# EAGLE design RPi-XBee-SMT (EAGLE 6.2)
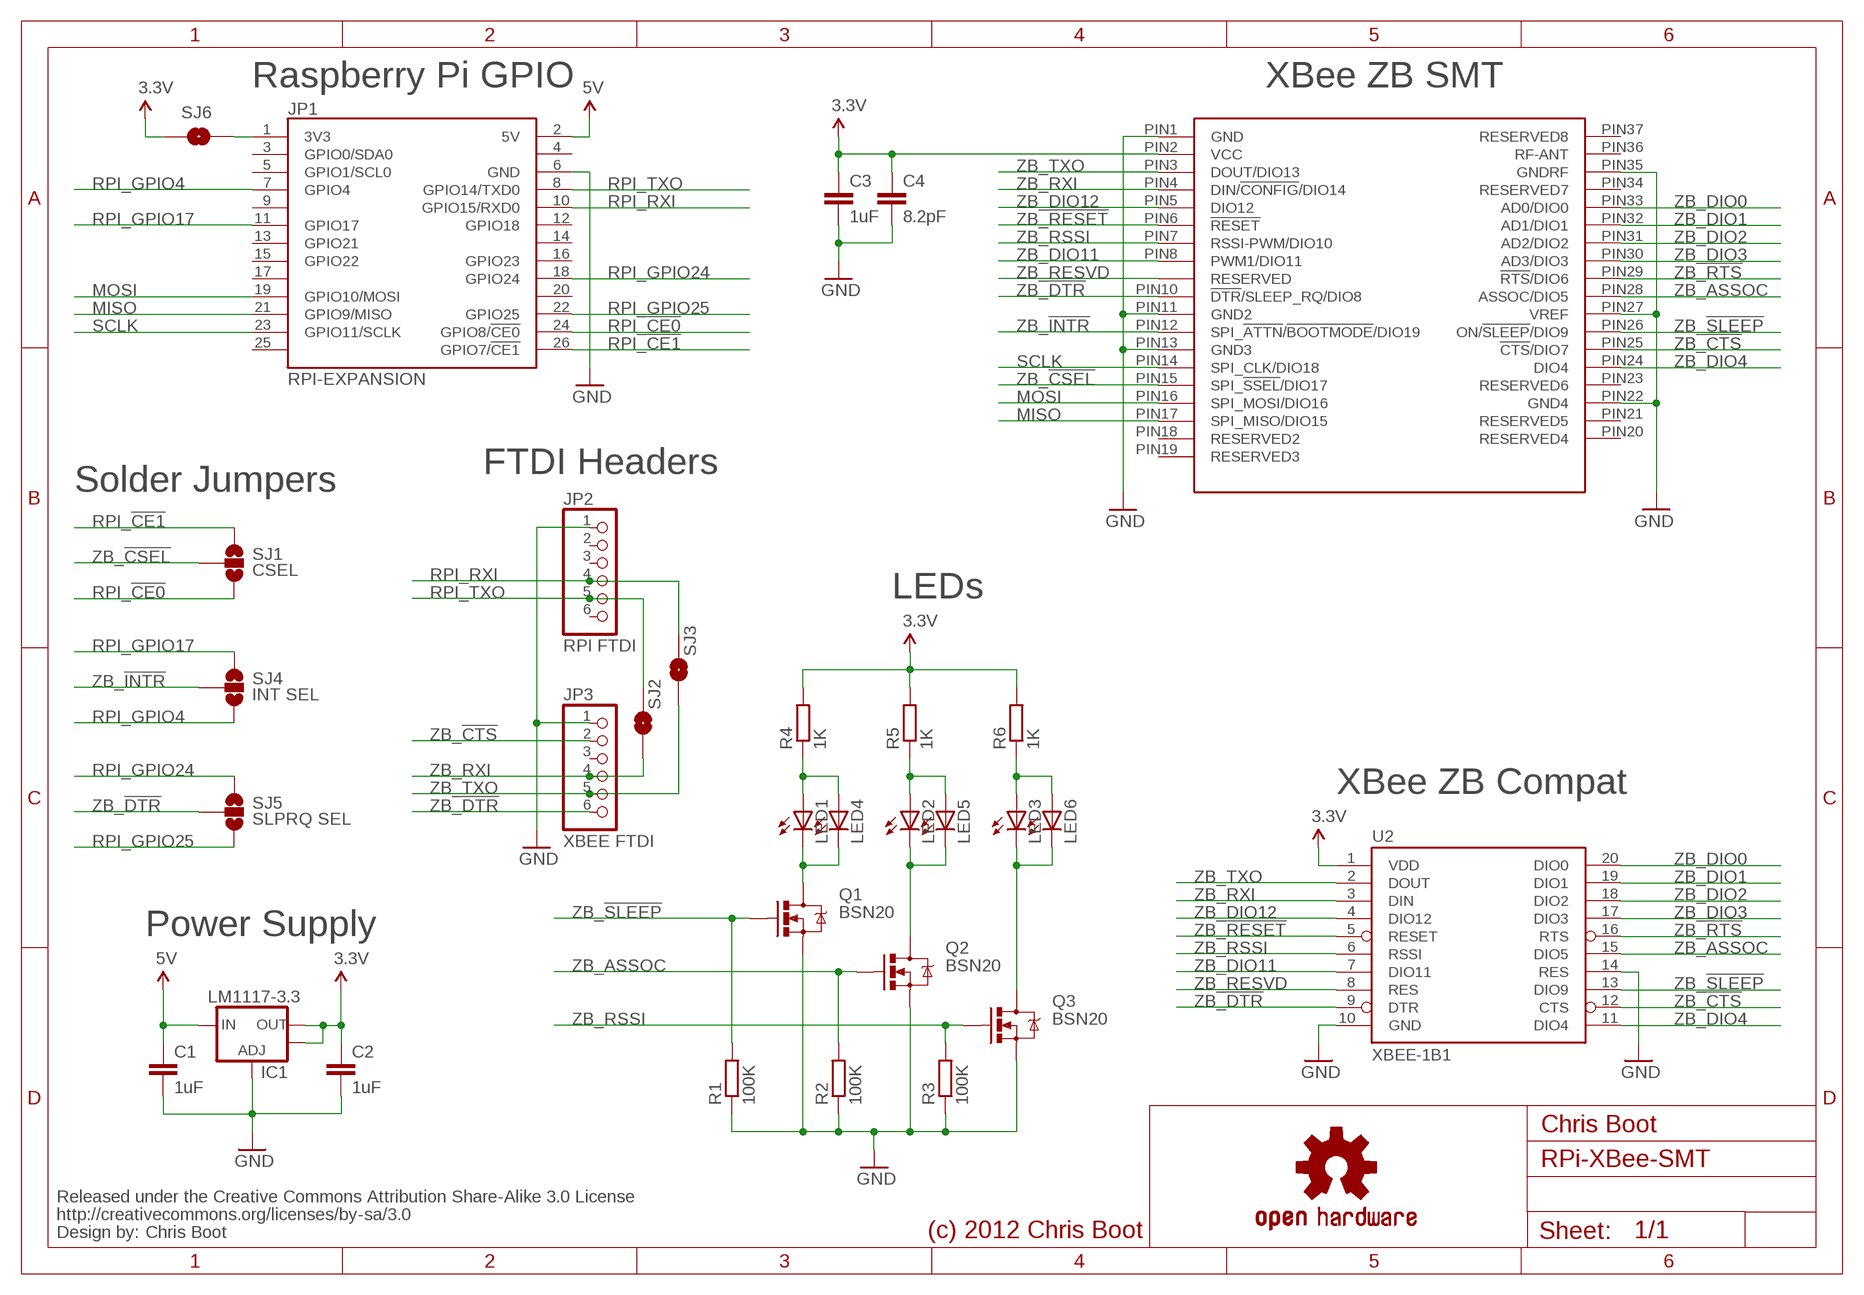
[diagram p0: schematic, sheet 1]

## Parts
C1  1uF  C-EUC0805  [C0805]
C2  1uF  C-EUC0805  [C0805]
C3  1uF  C-EUC0805  [C0805]
C4  8.2pF  C-EUC0805  [C0805]
IC1  LM1117-3.3  V_REG_LM1117SOT223  [SOT223]
JP1  RPI-EXPANSION  [2X13]
JP2  RPI FTDI  PINHD-1X6  [1X06]
JP3  XBEE FTDI  PINHD-1X6  [1X06]
LED1  LED-3MM-NO_SILK  [LED3MM-NS]
LED2  LED-3MM-NO_SILK  [LED3MM-NS]
LED3  LED-3MM-NO_SILK  [LED3MM-NS]
LED4  LED0603  [LED-0603]
LED5  LED0603  [LED-0603]
LED6  LED0603  [LED-0603]
Q1  BSN20  MOSFET-NCHANNELSMD  [SOT23-3]
Q2  BSN20  MOSFET-NCHANNELSMD  [SOT23-3]
Q3  BSN20  MOSFET-NCHANNELSMD  [SOT23-3]
R1  100K  R-EU_R0805  [R0805]
R2  100K  R-EU_R0805  [R0805]
R3  100K  R-EU_R0805  [R0805]
R4  1K  R-EU_R0805  [R0805]
R5  1K  R-EU_R0805  [R0805]
R6  1K  R-EU_R0805  [R0805]
SJ1  CSEL  SOLDERJUMPER_2WAYS  [SJ_3]
SJ2  SOLDERJUMPERNO  [SJ_2S-NO]
SJ3  SOLDERJUMPERNO  [SJ_2S-NO]
SJ4  INT SEL  SOLDERJUMPER_2WAYS  [SJ_3]
SJ5  SLPRQ SEL  SOLDERJUMPER_2WAYS  [SJ_3]
SJ6  SOLDERJUMPERNO  [SJ_2S-NO]
U1  QUBIQ_XBEE-SMT  [QUBIQ_FLAT-RF]
U2  XBEE-1B1  [XBEE-1]
U$3  CREATIVE_COMMONS  [CREATIVE_COMMONS]
U$4  OSHW-LOGOL  [OSHW-LOGO-L]

## Nets
3.3V: C2.1 C3.1 C4.1 IC1.2(OUT) IC1.4(OUT) R4.2 R5.2 R6.2 SJ6.1 U1.PIN2(VCC) U2.1(VDD)
5V: C1.1 IC1.3(IN) JP1.2(5V)
GND: C1.2 C2.2 C3.2 C4.2 IC1.1(ADJ) JP1.6(GND) JP2.1 JP3.1 Q1.2(S) Q2.2(S) Q3.2(S) R1.1 R2.1 R3.1 U1.PIN1(GND) U1.PIN11(GND2) U1.PIN13(GND3) U1.PIN22(GND4) U1.PIN27(VREF) U1.PIN35(GNDRF) U2.10(GND) U2.14(RES)
MISO: JP1.21(GPIO9/MISO) U1.PIN17(SPI_MISO/DIO15)
MOSI: JP1.19(GPIO10/MOSI) U1.PIN16(SPI_MOSI/DIO16)
N$1: LED1.K(C) LED4.C Q1.3(D)
N$5: LED2.K(C) LED5.C Q2.3(D)
N$6: LED3.K(C) LED6.C Q3.3(D)
N$10: LED1.A LED4.A R4.1
N$12: LED2.A LED5.A R5.1
N$14: LED3.A LED6.A R6.1
RPI_3.3V: JP1.1(3V3) SJ6.2
RPI_!CE0: JP1.24(GPIO8/!CE0) SJ1.3
RPI_!CE1: JP1.26(GPIO7/!CE1) SJ1.1
RPI_GPIO4: JP1.7(GPIO4) SJ4.3
RPI_GPIO17: JP1.11(GPIO17) SJ4.1
RPI_GPIO24: JP1.18(GPIO24) SJ5.1
RPI_GPIO25: JP1.22(GPIO25) SJ5.3
RPI_RXI: JP1.10(GPIO15/RXD0) JP2.4 SJ3.2
RPI_TXO: JP1.8(GPIO14/TXD0) JP2.5 SJ2.2
SCLK: JP1.23(GPIO11/SCLK) U1.PIN14(SPI_CLK/DIO18)
ZB_!CSEL: SJ1.2 U1.PIN15(SPI_!SSEL!/DIO17)
ZB_!CTS: JP3.2 U1.PIN25(!CTS!/DIO7) U2.12(CTS)
ZB_!DTR: JP3.6 SJ5.2 U1.PIN10(!DTR!/SLEEP_RQ/DIO8) U2.9(DTR)
ZB_!INTR: SJ4.2 U1.PIN12(SPI_!ATTN!/!BOOTMODE!/DIO19)
ZB_!RESET: U1.PIN6(!RESET) U2.5(RESET)
ZB_!RTS: U1.PIN29(!RTS!/DIO6) U2.16(RTS)
ZB_!SLEEP: Q1.1(G) R1.2 U1.PIN26(ON/!SLEEP!/DIO9) U2.13(DIO9)
ZB_ASSOC: Q2.1(G) R2.2 U1.PIN28(ASSOC/DIO5) U2.15(DIO5)
ZB_DIO0: U1.PIN33(AD0/DIO0) U2.20(DIO0)
ZB_DIO1: U1.PIN32(AD1/DIO1) U2.19(DIO1)
ZB_DIO2: U1.PIN31(AD2/DIO2) U2.18(DIO2)
ZB_DIO3: U1.PIN30(AD3/DIO3) U2.17(DIO3)
ZB_DIO4: U1.PIN24(DIO4) U2.11(DIO4)
ZB_DIO11: U1.PIN8(PWM1/DIO11) U2.7(DIO11)
ZB_DIO12: U1.PIN5(DIO12) U2.4(DIO12)
ZB_RESVD: U1.PIN9(RESERVED) U2.8(RES)
ZB_RSSI: Q3.1(G) R3.2 U1.PIN7(RSSI-PWM/DIO10) U2.6(RSSI)
ZB_RXI: JP3.4 SJ2.1 U1.PIN4(DIN/!CONFIG!/DIO14) U2.3(DIN)
ZB_TXO: JP3.5 SJ3.1 U1.PIN3(DOUT/DIO13) U2.2(DOUT)
Unconnected: JP1.3(GPIO0/SDA0) JP1.4(NC0) JP1.5(GPIO1/SCL0) JP1.9(NC1) JP1.12(GPIO18) JP1.13(GPIO21) JP1.14(NC3) JP1.15(GPIO22) JP1.16(GPIO23) JP1.17(NC4) JP1.20(NC5) JP1.25(NC6) JP2.2 JP2.3 JP2.6 JP3.3 U1.PIN18(RESERVED2) U1.PIN19(RESERVED3) U1.PIN20(RESERVED4) U1.PIN21(RESERVED5) U1.PIN23(RESERVED6) U1.PIN34(RESERVED7) U1.PIN36(RF-ANT) U1.PIN37(RESERVED8)

## Notes on the sheet
- Raspberry Pi GPIO | XBee ZB SMT
- FTDI Headers
- Solder Jumpers
- LEDs
- XBee ZB Compat
- Power Supply
- Chris Boot
- Chris Boot | (c) 2012 Chris Boot

## Library data of the parts
C1-C4 = resistor:C-EU: CAPACITOR, European symbol
IC1 = SparkFun-PowerIC:V_REG_LM1117: Voltage Regulator LM1117 Standard adjustable voltage regulator but in SMD form. Spark Fun Electronics SKU : COM-00595
JP1 = raspberrypi:RPI-EXPANSION
JP2 JP3 = custom:PINHD-1X6: PIN HEADER
LED1-LED6 = SparkFun-LED:LED: LEDs Standard schematic elements and footprints for 5mm, 3mm, 1206, and 0603 sized LEDs. 5mm - Spark Fun Electronics SKU : COM-00529 (and others)
Q1-Q3 = SparkFun-DiscreteSemi:MOSFET-NCHANNEL: Generic NMOS footprint
R1-R6 = resistor:R-EU_: RESISTOR, European symbol
SJ1 SJ4 SJ5 = SparkFun-Passives:SOLDERJUMPER_2WAY: Solder Jumper 2 way solder jumper
SJ2 SJ3 SJ6 = SparkFun-Passives:SOLDERJUMPER: Solder Jumper Standard SMD solder jumper. Used to automate production. Two varients : Normally Open and Normally Closed are the same, but have different paste layers. NC will have a large amount of paste and should jumper during reflow.
U1 = xbee-smt:QUBIQ_XBEE-SMT
U2 = SparkFun-RF:XBEE-1: Xbee module footprints
U$3 = SparkFun-Aesthetics:CREATIVE_COMMONS: Creative Commons License summary
U$4 = SparkFun-Aesthetics:OSHW-LOGO: Open Source Hardware Logo This logo indicates the piece of hardware it is found on incorporates a OSHW license and/or adheres to the definition of open source hardware found here: http://freedomdefined.org/OSHW

## Net classes
0 default: width 0.305 mm

## Board
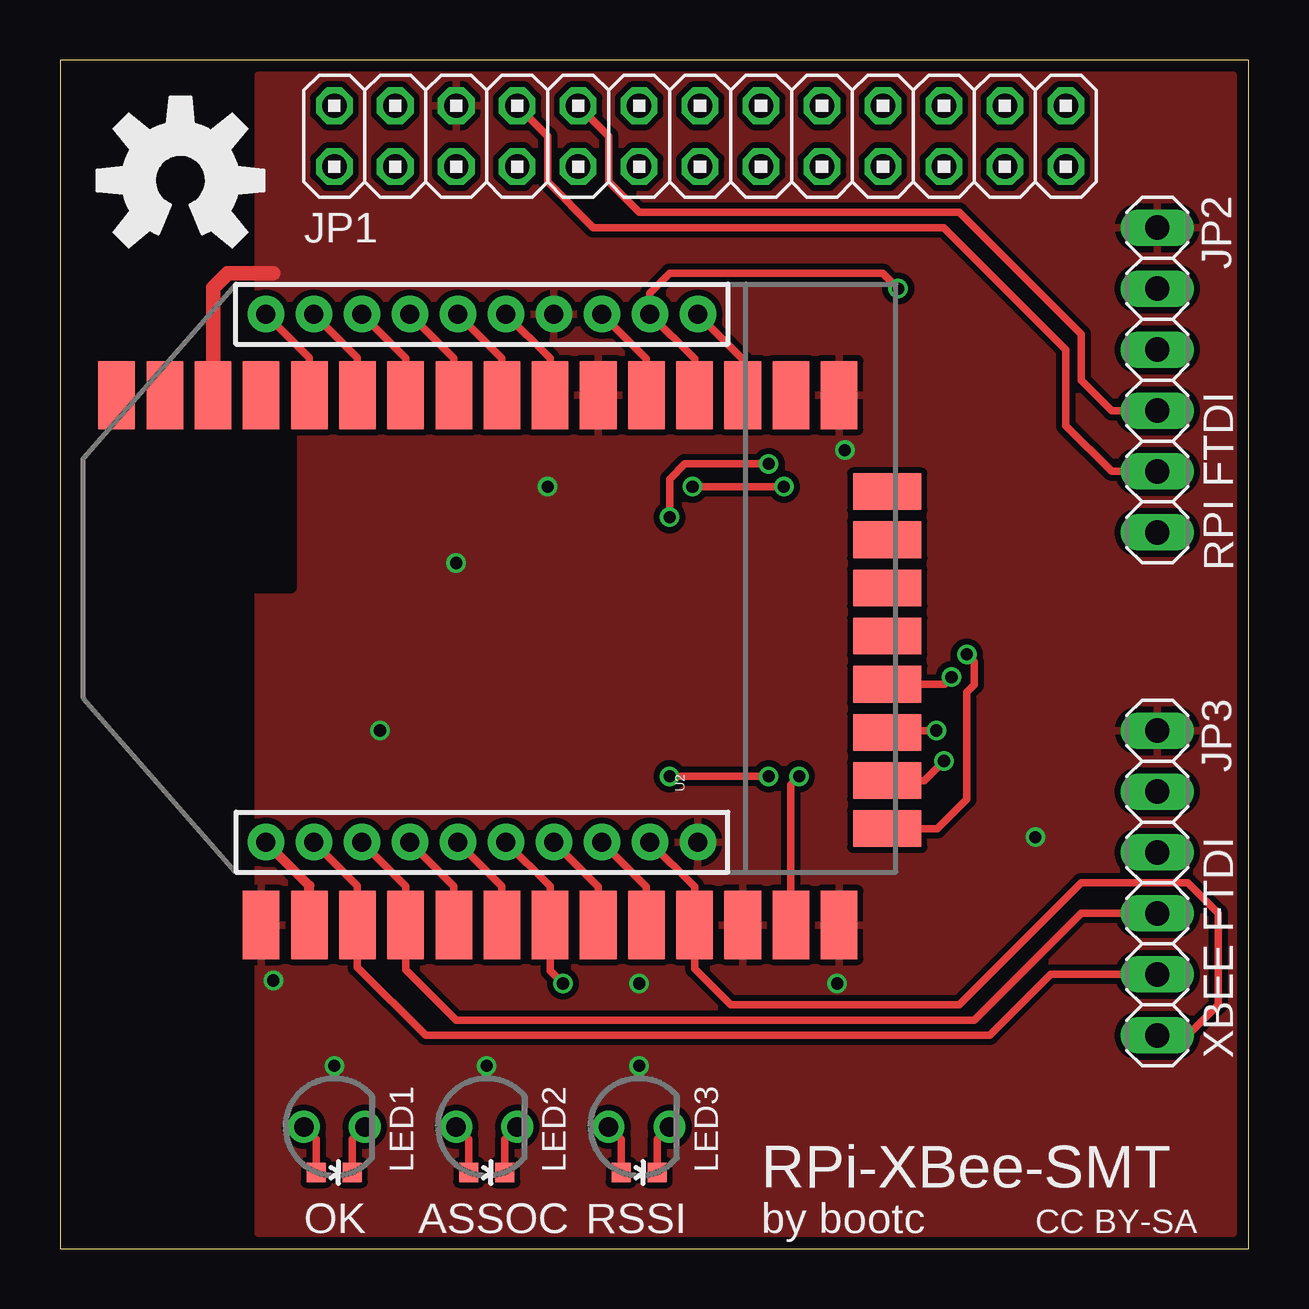
[diagram p1: board, top side]
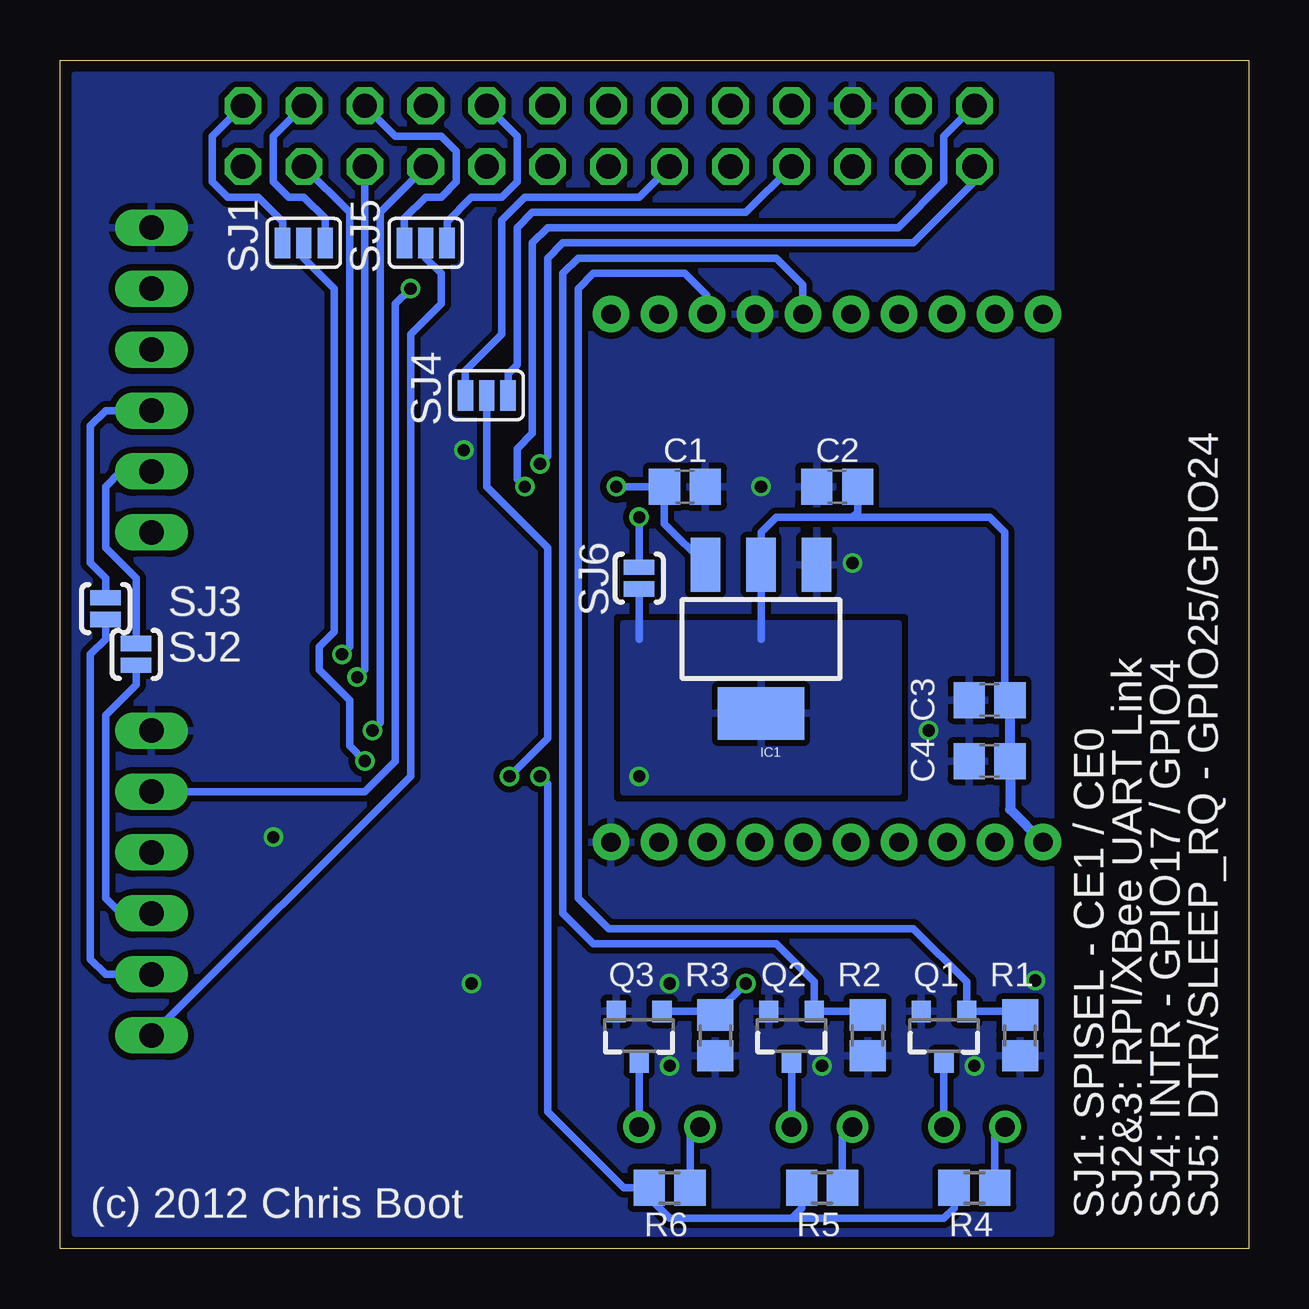
[diagram p2: board, bottom side, seen from below]

Size 49.53 x 49.53 mm. Coordinates in mm from the lower left corner, seen from the top.
Outline: 0,0 49.53,0 49.53,49.53 0,49.53 0,0
Copper layers (1*16): Top 0.035mm / dielectric 1.5mm / Bottom 0.035mm
Design rules: minimum track width 6mil, minimum drill 12mil, track to track 6mil, track to pad 6mil, pad to pad 6mil, via to via 6mil, smd to smd 0mil, copper to edge 10mil, drill to drill 10mil, minimum pad ring 10mil, minimum via ring 6mil, stop-mask expansion 2mil, vias tented up to drill 100mil, thermal gap 10mil

### Footprints (pad centres in the part's own frame; a part is rotated, then mirrored left to right if it is on the bottom)
C0805 = smd 1.3 x 1.5: 1 -0.85,0; 2 0.85,0
SOT223 = smd 1.219 x 2.235: 1 -2.311,-3.099; 2 0,-3.099; 3 2.311,-3.099 | smd 3.6 x 2.2: 4 0,3.099
2X13 = drill 1.016 octagon: 1 -15.24,-1.27; 2 -15.24,1.27; 3 -12.7,-1.27; 4 -12.7,1.27; 5 -10.16,-1.27; 6 -10.16,1.27; 7 -7.62,-1.27; 8 -7.62,1.27; 9 -5.08,-1.27; 10 -5.08,1.27; 11 -2.54,-1.27; 12 -2.54,1.27; 13 0,-1.27; 14 0,1.27; 15 2.54,-1.27; 16 2.54,1.27; 17 5.08,-1.27; 18 5.08,1.27; 19 7.62,-1.27; 20 7.62,1.27; 21 10.16,-1.27; 22 10.16,1.27; 23 12.7,-1.27; 24 12.7,1.27; 25 15.24,-1.27; 26 15.24,1.27
1X06 = drill 1.016 long: 1 -6.35,0; 2 -3.81,0; 3 -1.27,0; 4 1.27,0; 5 3.81,0; 6 6.35,0
LED3MM-NS = drill 0.813: A -1.27,0; K 1.27,0
LED-0603 = smd 0.8 x 0.8: A 0,-0.75; C 0,0.75
SOT23-3 = smd 0.8 x 0.9: 1 -0.95,-1; 2 0.95,-1; 3 0,1.1
R0805 = smd 1.3 x 1.5: 1 -0.85,0; 2 0.85,0
SJ_3 = smd 0.635 x 1.27: 1 -0.889,0; 2 0,0; 3 0.889,0
SJ_2S-NO = smd 0.635 x 1.27: 1 -0.45,0; 2 0.45,0
QUBIQ_FLAT-RF = smd 2.845 x 1.524: PIN1 -22.073,10.033; PIN2 -22.073,8.026; PIN3 -22.073,6.02; PIN4 -22.073,4.013; PIN5 -22.073,2.007; PIN6 -22.073,0; PIN7 -22.073,-2.007; PIN8 -22.073,-4.013; PIN9 -22.073,-6.02; PIN10 -22.073,-8.026; PIN11 -22.073,-10.033; PIN12 -22.073,-12.04; PIN13 -22.073,-14.046; PIN22 0,-14.046; PIN23 0,-12.04; PIN24 0,-10.033; PIN25 0,-8.026; PIN26 0,-6.02; PIN27 0,-4.013; PIN28 0,-2.007; PIN29 0,0; PIN30 0,2.007; PIN31 0,4.013; PIN32 0,6.02; PIN33 0,8.026; PIN34 0,10.033; PIN35 0,12.04; PIN36 0,14.046; PIN37 0,16.053 | smd 1.524 x 2.845: PIN14 -18.059,-16.053; PIN15 -16.053,-16.053; PIN16 -14.046,-16.053; PIN17 -12.04,-16.053; PIN18 -10.033,-16.053; PIN19 -8.026,-16.053; PIN20 -6.02,-16.053; PIN21 -4.013,-16.053
XBEE-1 = drill 0.8 pad 1.524: 1 -11,20; 2 -11,18; 3 -11,16; 4 -11,14; 5 -11,12; 6 -11,10; 7 -11,8; 8 -11,6; 9 -11,4; 10 -11,2; 11 11,2; 12 11,4; 13 11,6; 14 11,8; 15 11,10; 16 11,12; 17 11,14; 18 11,16; 19 11,18; 20 11,20

### Placement (x,y rotation side)
C1  23.5,31.75 0 bottom
C2  17.14,31.75 180 bottom
C3  10.79,22.86 180 bottom
C4  10.79,20.32 180 bottom
IC1  20.32,25.4 180 bottom
JP1  26.67,46.35 0 top
JP2  45.72,36.2 270 top
JP3  45.72,15.24 270 top
LED1  11.43,5.08 0 top
LED2  17.78,5.08 0 top
LED3  24.13,5.08 0 top
LED4  11.43,3.17 270 top
LED5  17.78,3.17 270 top
LED6  24.13,3.17 270 top
Q1  12.7,8.89 180 bottom
Q2  19.05,8.89 180 bottom
Q3  25.4,8.89 180 bottom
R1  9.53,8.89 90 bottom
R2  15.88,8.89 90 bottom
R3  22.23,8.89 90 bottom
R4  11.43,2.54 180 bottom
R5  17.78,2.54 180 bottom
R6  24.13,2.54 180 bottom
SJ1  39.37,41.91 0 bottom
SJ2  46.35,24.77 90 bottom
SJ3  47.62,26.67 90 bottom
SJ4  31.75,35.56 0 bottom
SJ5  34.29,41.91 180 bottom
SJ6  25.4,27.94 90 bottom
U1  18.41,35.56 90 top
U2  28.57,27.94 90 top
U$3  3.81,43.18 0 top
U$4  5.02,44.51 0 top

### Tracks (layer width: path | path; a pad name or v marks a point on that pad's centre or on a via)
3.3V  (via drill 0.51)
  Top 0.305: v25.4,19.68 v29.53,19.68
  Top 0.406: U1.PIN2 10.39,15.13 U2.1
  Bottom 0.305: 16.51,30.48 19.68,30.48 20.32,29.84 IC1.2 20.32,25.4 | 16.51,30.48 10.79,30.48 10.16,29.84 10.16,23.07 C3.1 | C2.1 16.3,30.7 16.51,30.48 | v29.53,19.68 29.21,19.37 29.21,5.71 26.04,2.54 R6.2 24.98,2.12 24.13,1.27 19.05,1.27 | 19.05,1.27 12.7,1.27 12.28,1.69 R4.2 | R5.2 18.63,1.69 19.05,1.27 | SJ6.1 25.4,25.4
  Bottom 0.406: C3.1 C4.1 9.95,18.31 U2.1
  pour Bottom (isolate 0.305): 14.61,26.04 14.61,19.05 26.04,19.05 26.04,26.04
5V  (via drill 0.51)
  Top 0.305: v30.16,31.75 v26.35,31.75
  Bottom 0.305: v26.35,31.75 C1.1 24.34,30.21 IC1.3 | JP1.2 12.7,46.35 12.7,44.45 14.61,42.55 29.21,42.55 29.84,41.91 29.84,33.97 30.48,33.34 30.48,32.07 v30.16,31.75
GND  (via drill 0.51)
  Top 0.61: U1.PIN35 6.38,40.03 6.99,40.64 8.89,40.64
  other vias: 8.89,11.18 24.13,11.05 32.38,11.05 32.7,33.27 20.32,31.75 16.51,28.57 13.34,21.59 40.64,17.14 11.43,7.62 17.78,7.62 24.13,7.62
  pour Bottom (isolate 0.254, rank 2): 8.26,48.9 48.9,48.9 48.9,0.64 8.26,0.64
  pour Top (isolate 0.254, rank 2): 8.26,48.9 48.9,48.9 48.9,0.64 8.26,0.64
MISO  (via drill 0.51)
  Top 0.305: U1.PIN17 36.85,23.52 v37.15,23.81
  Bottom 0.305: v37.15,23.81 36.83,24.13 JP1.21
MOSI  (via drill 0.51)
  Top 0.305: v36.51,21.59 34.54,21.59 U1.PIN16
  Bottom 0.305: v36.51,21.59 36.2,21.91 36.2,43.18 JP1.19
N$1
  Top 0.305: LED4.C 12.18,4.56 LED1.K
  Bottom 0.305: Q1.3 LED1.K
N$5
  Top 0.305: LED5.C 18.53,4.56 LED2.K
  Bottom 0.305: Q2.3 LED2.K
N$6
  Top 0.305: LED6.C 24.88,4.56 LED3.K
  Bottom 0.305: Q3.3 LED3.K
N$10
  Top 0.305: LED4.A 10.68,4.56 LED1.A
  Bottom 0.305: R4.1 10.58,4.66 LED1.A
N$12
  Top 0.305: LED5.A 17.03,4.56 LED2.A
  Bottom 0.305: R5.1 16.93,4.66 LED2.A
N$14
  Top 0.305: LED6.A 23.38,4.56 LED3.A
  Bottom 0.305: R6.1 23.28,4.66 LED3.A
RPI_3.3V  (via drill 0.51)
  Top 0.305: v29.53,32.7 26.04,32.7 25.4,32.07 v25.4,30.48
  Bottom 0.305: JP1.1 11.43,44.45 13.97,41.91 28.57,41.91 29.21,41.27 29.21,33.02 v29.53,32.7 | v25.4,30.48 SJ6.2
RPI_!CE0
  Bottom 0.305: SJ1.3 38.48,42.93 39.37,43.81 40.01,43.81 40.64,44.45 40.64,46.35 JP1.24
RPI_!CE1
  Bottom 0.305: SJ1.1 40.26,42.8 41.27,43.81 42.55,43.81 43.18,44.45 43.18,46.35 JP1.26
RPI_GPIO4
  Bottom 0.305: JP1.7 20.95,43.18 29.84,43.18 30.48,42.55 30.48,36.83 30.86,36.45 SJ4.3
RPI_GPIO17
  Bottom 0.305: JP1.11 25.4,43.81 30.16,43.81 31.11,42.86 31.11,38.1 32.64,36.58 SJ4.1
RPI_GPIO24
  Bottom 0.305: SJ5.1 33.4,42.8 32.38,43.81 31.11,43.81 30.48,44.45 30.48,46.35 JP1.18
RPI_GPIO25
  Bottom 0.305: SJ5.3 35.18,42.93 34.29,43.81 33.66,43.81 33.02,44.45 33.02,45.72 33.66,46.35 35.56,46.35 JP1.22
RPI_RXI
  Top 0.305: JP2.4 43.81,34.92 42.55,36.2 42.55,38.1 37.47,43.18 24.13,43.18 22.86,44.45 22.86,46.35 JP1.10
  Bottom 0.305: SJ3.2 47.62,27.94 48.26,28.57 48.26,34.29 47.62,34.92 JP2.4
RPI_TXO
  Top 0.305: JP2.5 43.81,32.38 41.91,34.29 41.91,37.47 36.83,42.55 22.23,42.55 20.32,44.45 20.32,46.35 JP1.8
  Bottom 0.305: JP2.5 46.99,32.38 47.62,31.75 47.62,29.21 46.35,27.94 SJ2.2
SCLK  (via drill 0.51)
  Top 0.305: U1.PIN14 36.55,17.5 37.78,18.73 37.78,23.18 38.1,23.5 38.1,24.45 v37.78,24.77
  Bottom 0.305: v37.78,24.77 37.47,25.08 37.47,43.18 JP1.23
ZB_!CSEL  (via drill 0.51)
  Top 0.305: U1.PIN15 36.02,19.51 v36.83,20.32
  Bottom 0.305: v36.83,20.32 37.47,20.95 37.47,22.86 38.73,24.13 38.73,25.08 38.1,25.72 38.1,40.01 39.37,41.27 SJ1.2
ZB_!CTS  (via drill 0.51)
  Top 0.305: U1.PIN25 26.44,37.07 U2.12 24.57,39.81 25.4,40.64 34.29,40.64 v34.92,40.01
  Bottom 0.305: JP3.2 36.83,19.05 35.56,20.32 35.56,39.37 v34.92,40.01
ZB_!DTR
  Top 0.305: JP3.6 46.99,8.89 48.26,10.16 48.26,13.97 46.99,15.24 42.55,15.24 37.47,10.16 27.94,10.16 26.44,11.66 U1.PIN10 26.44,15.07 U2.9
  Bottom 0.305: SJ5.2 34.29,41.27 33.66,40.64 33.66,39.37 34.92,38.1 34.92,19.68 JP3.6
ZB_!INTR  (via drill 0.51)
  Top 0.305: U1.PIN12 30.45,19.34 v30.8,19.68
  Bottom 0.305: SJ4.2 31.75,31.75 29.21,29.21 29.21,21.27 v30.8,19.68
ZB_!RESET
  Top 0.305: U1.PIN6 18.41,15.1 U2.5
ZB_!RTS
  Top 0.305: U1.PIN29 18.41,37.1 U2.16
ZB_!SLEEP
  Top 0.305: U1.PIN26 24.43,37.08 U2.13
  Bottom 0.305: R1.2 9.53,9.89 Q1.1 11.75,11.12 13.97,13.34 26.67,13.34 27.94,14.61 27.94,40.01 27.3,40.64 23.5,40.64 22.57,39.72 U2.13
ZB_ASSOC
  Top 0.305: U1.PIN28 20.42,37.09 U2.15
  Bottom 0.305: R2.2 15.88,9.89 Q2.1 18.1,11.12 19.68,12.7 27.3,12.7 28.57,13.97 28.57,40.64 27.94,41.27 19.68,41.27 18.57,40.16 U2.15
ZB_DIO0
  Top 0.305: U1.PIN33 10.39,37.13 U2.20
ZB_DIO1
  Top 0.305: U1.PIN32 12.39,37.12 U2.19
ZB_DIO2
  Top 0.305: U1.PIN31 14.4,37.11 U2.18
ZB_DIO3
  Top 0.305: U1.PIN30 16.41,37.11 U2.17
ZB_DIO4
  Top 0.305: U1.PIN24 28.45,37.07 U2.11
ZB_DIO11
  Top 0.305: U1.PIN8 22.43,15.09 U2.7
ZB_DIO12
  Top 0.305: U1.PIN5 16.41,15.11 U2.4
ZB_RESVD
  Top 0.305: U1.PIN9 24.43,15.08 U2.8
ZB_RSSI  (via drill 0.51)
  Top 0.305: v20.95,11.05 20.42,11.58 U1.PIN7 20.42,15.09 U2.6
  Bottom 0.305: Q3.1 22.23,9.89 | 22.23,9.89 R3.2 | 22.23,9.89 22.11,9.89 v20.95,11.05
ZB_RXI
  Top 0.305: JP3.4 42.55,13.97 38.1,9.53 16.51,9.53 14.4,11.63 U1.PIN4 14.4,15.11 U2.3
  Bottom 0.305: JP3.4 46.99,13.97 47.62,14.61 47.62,22.23 46.35,23.5 SJ2.1
ZB_TXO
  Top 0.305: JP3.5 41.27,11.43 38.73,8.89 15.24,8.89 12.39,11.73 U1.PIN3 12.39,15.12 U2.2
  Bottom 0.305: SJ3.1 47.62,25.4 48.26,24.77 48.26,12.06 47.62,11.43 JP3.5

### Text on the board
tPlace: RPI FTDI | XBEE FTDI | RPi-XBee-SMT | OK | ASSOC | RSSI | by bootc | CC BY-SA
bPlace: SJ5: DTR/SLEEP_RQ - GPIO25/GPIO24 | SJ4: INTR - GPIO17 / GPIO4 | SJ2&3: RPI/XBee UART Link | SJ1: SPISEL - CE1 / CE0 | (c) 2012 Chris Boot